# Altium project RPI GPIO BOARD.PrjPcb
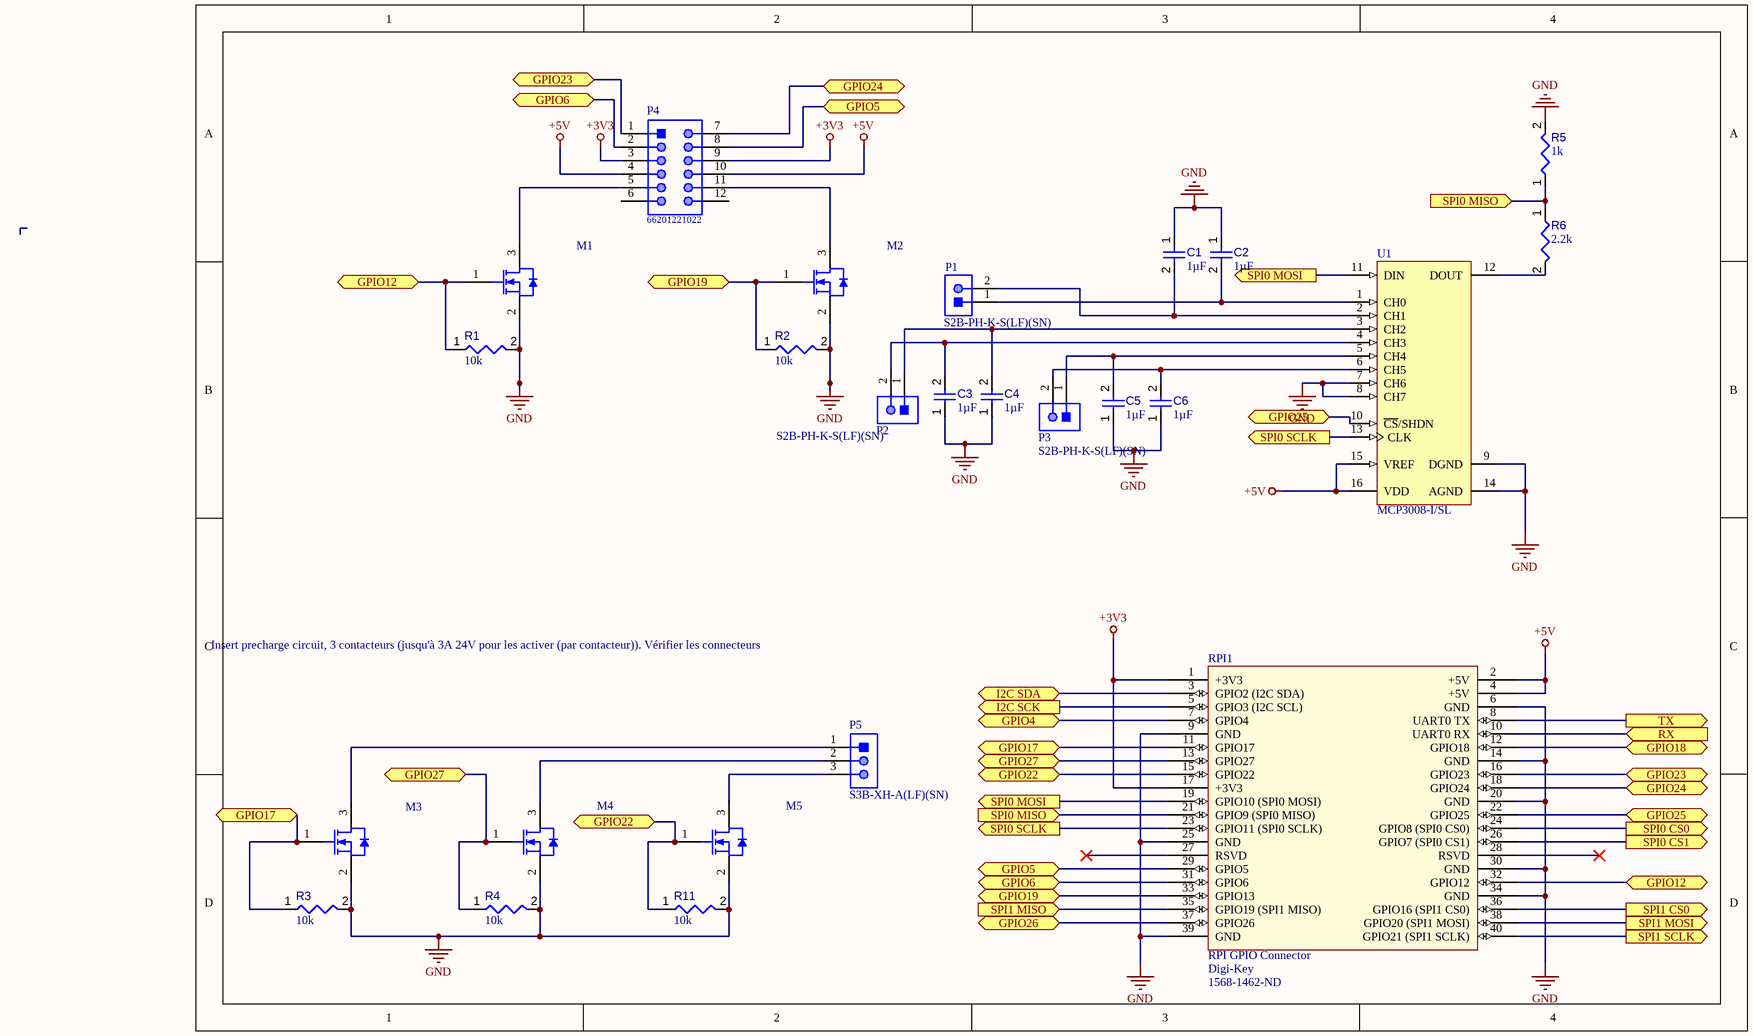
[diagram p0: RPI 3.SchDoc]
mProjectAuthor: Nils Minor; mProjectName: RPI BOARD; mProjectRevision: 0; mProjectVersion: 1
1 sheet, 25 parts. Net scope: flat (ports and power ports of the same name join across sheets).
Board file: RPI 3.PcbDoc

## Sheet RPI 3.SchDoc
size A4; SheetNumber: 1; SheetTotal: 1

### Parts
C1  value 1µF  [CAPC1005X55X25ML5T10]  (hidden comment: Capacitor 1 uF +/- 10% 6.3 V 1005)
C2  value 1µF  [CAPC1005X55X25ML5T10]  (hidden comment: Capacitor 1 uF +/- 10% 6.3 V 1005)
C3  value 1µF  [CAPC1005X55X25ML5T10]  (hidden comment: Capacitor 1 uF +/- 10% 6.3 V 1005)
C4  value 1µF  [CAPC1005X55X25ML5T10]  (hidden comment: Capacitor 1 uF +/- 10% 6.3 V 1005)
C5  value 1µF  [CAPC1005X55X25ML5T10]  (hidden comment: Capacitor 1 uF +/- 10% 6.3 V 1005)
C6  value 1µF  [CAPC1005X55X25ML5T10]  (hidden comment: Capacitor 1 uF +/- 10% 6.3 V 1005)
M1  BSS138  [FAIR-SOT23-3_V]  (value not drawn)
M2  BSS138  [FAIR-SOT23-3_V]  (value not drawn)
M3  BSS138  [FAIR-SOT23-3_V]  (value not drawn)
M4  BSS138  [FAIR-SOT23-3_V]  (value not drawn)
M5  BSS138  [FAIR-SOT23-3_V]  (value not drawn)
P1  S2B-PH-K-S(LF)(SN)  [JST-S2B-PH-K-S_V]
P2  S2B-PH-K-S(LF)(SN)  [JST-S2B-PH-K-S_V]
P3  S2B-PH-K-S(LF)(SN)  [JST-S2B-PH-K-S_V]
P4  66201221022  [66201221022]
P5  S3B-XH-A(LF)(SN)  [JST-S3B-XH-A(LF)(SN)_V]
R1  value 10k  [RESC0402(1005)_L]  (hidden comment: Resistor 10K  +/-1 % 0402 63 mW)
R2  value 10k  [RESC0402(1005)_L]  (hidden comment: Resistor 10K  +/-1 % 0402 63 mW)
R3  value 10k  [RESC0402(1005)_L]  (hidden comment: Resistor 10K  +/-1 % 0402 63 mW)
R4  value 10k  [RESC0402(1005)_L]  (hidden comment: Resistor 10K  +/-1 % 0402 63 mW)
R5  value 1k  [RESC1005X40X25ML10T10]  (hidden comment: Resistor 1k +/-5% 0402 63 mW)
R6  value 2.2k  [RESC0402(1005)_L]  (hidden comment: Resistor 2K2  +/-5 % 0402 63 mW)
R11  value 10k  [RESC0402(1005)_L]  (hidden comment: Resistor 10K  +/-1 % 0402 63 mW)
RPI1  RPI GPIO Connector  Supplier 1: Digi-Key  Supplier Part Number 1: 1568-1462-ND  [rpi]
U1  MCP3008-I/SL  [SOIC-SL16_L]

### Ports
GPIO4 (bidir), GPIO5 (bidir), GPIO6 (bidir), GPIO12 (bidir), GPIO17 (bidir), GPIO18 (bidir), GPIO19 (bidir), GPIO22 (bidir), GPIO23 (bidir), GPIO24 (bidir), GPIO25 (bidir), GPIO26 (bidir), GPIO27 (bidir), I2C SCK (out), I2C SDA (bidir), RX (in), SPI0 CS0 (out), SPI0 CS1 (out), SPI0 MISO (in), SPI0 MOSI (out), SPI0 SCLK (out), SPI1 CS0 (out), SPI1 MISO (in), SPI1 MOSI (out), SPI1 SCLK (out), TX (out)

### Nets
+3V3: P4.3 P4.9 RPI1.1(+3V3) RPI1.17(+3V3)
+5V: P4.4 P4.10 RPI1.2(+5V) RPI1.4(+5V) U1.15(VREF) U1.16(VDD)
GND: C1.1 C2.1 C3.1 C4.1 C5.1 C6.1 M1.2(S) M2.2(S) M3.2(S) M4.2(S) M5.2(S) R1.2 R2.2 R3.2 R4.2 R5.2 R11.2 RPI1.6(GND) RPI1.9(GND) RPI1.14(GND) RPI1.20(GND) RPI1.25(GND) RPI1.30(GND) RPI1.34(GND) RPI1.39(GND) U1.7(CH6) U1.8(CH7) U1.9(DGND) U1.14(AGND)
NetC1_2: C1.2 P1.2 U1.2(CH1)
NetC2_2: C2.2 P1.1 U1.1(CH0)
NetC3_2: C3.2 P2.2 U1.4(CH3)
NetC4_2: C4.2 P2.1 U1.3(CH2)
NetC5_2: C5.2 P3.1 U1.5(CH4)
NetC6_2: C6.2 P3.2 U1.6(CH5)
NetM1_1: M1.1(G) R1.1 RPI1.32(GPIO12) ; port GPIO12
NetM1_3: M1.3(D) P4.5
NetM2_1: M2.1(G) R2.1 RPI1.33(GPIO13) ; port GPIO19
NetM2_3: M2.3(D) P4.11
NetM3_1: M3.1(G) R3.1 RPI1.11(GPIO17) ; port GPIO17
NetM3_3: M3.3(D) P5.1
NetM4_1: M4.1(G) R4.1 RPI1.13(GPIO27) ; port GPIO27
NetM4_3: M4.3(D) P5.2
NetM5_1: M5.1(G) R11.1 RPI1.15(GPIO22) ; port GPIO22
NetM5_3: M5.3(D) P5.3
NetP4_1: P4.1 RPI1.16(GPIO23) ; port GPIO23
NetP4_2: P4.2 RPI1.31(GPIO6) ; port GPIO6
NetP4_7: P4.7 RPI1.18(GPIO24) ; port GPIO24
NetP4_8: P4.8 RPI1.29(GPIO5) ; port GPIO5
NetR5_1: R5.1 R6.1 RPI1.21(GPIO9_(SPI0_MISO)) ; port SPI0 MISO
NetR6_2: R6.2 U1.12(DOUT)
NetRPI1_3: RPI1.3(GPIO2_(I2C_SDA)) ; port I2C SDA
NetRPI1_5: RPI1.5(GPIO3_(I2C_SCL)) ; port I2C SCK
NetRPI1_7: RPI1.7(GPIO4) ; port GPIO4
NetRPI1_8: RPI1.8(UART0_TX) ; port TX
NetRPI1_10: RPI1.10(UART0_RX) ; port RX
NetRPI1_12: RPI1.12(GPIO18) ; port GPIO18
NetRPI1_19: RPI1.19(GPIO10_(SPI0_MOSI)) U1.11(DIN) ; port SPI0 MOSI
NetRPI1_22: RPI1.22(GPIO25) U1.10(~{CS}/SHDN) ; port GPIO25
NetRPI1_23: RPI1.23(GPIO11_(SPI0_SCLK)) U1.13(CLK) ; port SPI0 SCLK
NetRPI1_24: RPI1.24(GPIO8_(SPI0_CS0)) ; port SPI0 CS0
NetRPI1_26: RPI1.26(GPIO7_(SPI0_CS1)) ; port SPI0 CS1
NetRPI1_35: RPI1.35(GPIO19_(SPI1_MISO)) ; port SPI1 MISO
NetRPI1_36: RPI1.36(GPIO16_(SPI1_CS0)) ; port SPI1 CS0
NetRPI1_37: RPI1.37(GPIO26) ; port GPIO26
NetRPI1_38: RPI1.38(GPIO20_(SPI1_MOSI)) ; port SPI1 MOSI
NetRPI1_40: RPI1.40(GPIO21_(SPI1_SCLK)) ; port SPI1 SCLK

Not connected (* = marked no-connect by the designer): P4 6 12; RPI1 27(RSVD)* 28(RSVD)*

### Notes on the sheet
- Insert precharge circuit, 3 contacteurs (jusqu'à 3A 24V pour les activer (par contacteur)). Vérifier les connecteurs

### Library data of the parts
C1-C6 = CMP-001-00009-6: Chip Capacitor, 1 uF, +/- 10%, 6.3 V, 1005 (0402 Metric); Voltage Rating: 6.3V; Capacitor Type: Ceramic; Min Operating Temperature: -55°C; Case/Package: 0402; Tolerance: 10%; Mounting Technology: SM; Max Operating Temperature: 85°C; RoHS Compliant: True; Pins: 2
M1-M5 = CMP-013-00021-4: N-Channel Logic Level Enhancement Mode Field Effect Transistor, 220 mA, 50 V, -55 to 150 degC, 3-Pin SOT-23, RoHS, Tape and Reel; Manufacturer: Fairchild; Elements: 1; Nominal Vgs: 1.3V; Resistance: 0.7Ohm; Typical Rise Time: 9ns; Rds On Max: 3.5Ohm; Nominal Dual Supply Voltage: 50V; Input Capacitance: 27pF; Package Version: Rev. 12, 03/2016; Power: 360mW; Packaging: TapeandReel; Package Description: 3-Pin Small Outline Transistor, Body 2.92 x 1.325 mm, Pitch 0.95 mm; Datasheet URL: https://www.fairchildsemi.com/datasheets/BS/BSS138.pdf; Min Operating Temperature: -55°C; Pins: 3; RoHS Compliant: True; Package Reference: SOT23-3; Package Quantity: 1; Case/Package: TO-236-3; Mounting Technology: SM; Max Operating Temperature: 150°C; Datasheet Version: Rev. C, 10/2005
P1-P3 = CMP-002-00030-2: Male Header, Pitch 2 mm, 1 x 2 Position, Height 4.8 mm, Tail Length 3.4 mm, -25 to 85 degC, RoHS, Bulk; Manufacturer: Japan Solderless Terminals; Package Reference: S2B-PH-K-S; Case/Package: S2B-PH-K-S; Datasheet URL: http://www.jst-mfg.com/product/pdf/eng/ePH.pdf; RoHS Compliant: Unknown; Datasheet Version: Dec-12; Gender: Male; Min Operating Temperature: -25°C; Max Operating Temperature: 85°C; Package Description: Male Header, Pitch 2 mm, 1 x 2 Position, Height 4.8 mm, Tail Length 3.4 mm; Connector Type: Header; Mounting Technology: SM
P4 = CMP-002-00072-1: THT Male Header WR-MPC3, with Snap-in Plastic Pegs, Right Angled, Dual Row, pitch 3 mm, 12 pins
P5 = CMP-002-00033-2: Male Header, Pitch 2.5 mm, 1 x 3 Position, Height 6.1 mm, Tail Length 3.4 mm, -25 to 85 degC, RoHS, Bulk; Manufacturer: JST; Package Description: Male Header, Pitch 2.5 mm, 1 x 3 Position, Height 6.1 mm, Tail Length 3.4 mm; Manufacturer URL: http://www.jst.com/home2.html; Datasheet URL: http://www.jst-mfg.com/product/pdf/eng/eXH.pdf; RoHS Compliant: Unknown; Connector Type: Header; Package Reference: S3B-XH-A(LF)(SN); Gender: Male; Case/Package: S3B-XH-A(LF)(SN); Mounting Technology: TH; Max Operating Temperature: 85°C; Min Operating Temperature: -25°C; Datasheet Version: May-16
R1-R4 R11 = CMP-009-00149-3: Chip Resistor, 10 kOhms, +/-1 %, 63 mW, -55 to 125 degC, 0402; Power: 63mW; Tolerance: 1%; Min Operating Temperature: -55°C; Case/Package: 0402; Max Operating Temperature: 155°C; Pins: 2
R5 = CMP-009-00013-5: Chip Resistor, 1 KOhm, +/- 5%, 0.063 W, -55 to 155 degC, 0402 (1005 Metric); Power: 63mW; Tolerance: 5%; Case/Package: 0402; Mounting Technology: SM; Min Operating Temperature: -55°C; Pins: 2; Max Operating Temperature: 155°C; RoHS Compliant: True
R6 = CMP-009-00166-3: Chip Resistor, 2,2 kOhms, +/-5 %, 63 mW, -55 to 155 degC, 0402; Power: 63mW; Tolerance: 5%; Pins: 2; Min Operating Temperature: -55°C; Max Operating Temperature: 155°C; Case/Package: 0402
RPI1 = rpi connector: GPIO Header for Raspberry Pi A+/B+/Pi 2/Pi 3 - 2x20; Manufacturer: SparkFun Electronics; Manufacturer Part Number: PRT-14017; Nils Minor: author; nilsminor@web.de: mail; RoHS: RoHS Compliant; Category: Development Boards, Kits, Programmers; Stock 1: 150; Pricing 1: 1=1.84 (EUR); Part Status: Active; Accessory Type: Connector; For Use With/Related Products: Raspberry Pi; ComponentLink1URL: https://cdn.sparkfun.com/datasheets/Dev/RaspberryPi/12313.pdf; ComponentLink1Description: https://cdn.sparkfun.com/datasheets/Dev/RaspberryPi/12313.pdf
U1 = CMP-0188-00041-2: 2.7V 4-Channel/8-Channel 10-Bit A/D Converters with SPI Serial Interface, 16-Pin SOIC 150mil, Industrial Temperature; ComponentLink1URL: http://www.microchip.com/; ComponentLink3Description: Package Specification; PackageDescription: 16-Lead Plastic Small Outline (SL) - Narrow, 3.90mm Body [SOIC]; PackageVersion: revBB, Aug-2009; ComponentLink2Description: Datasheet; Code_IPC: SOIC127P600-16; RevisionNote: URLs added.; ComponentLink3URL: http://www.microchip.com/stellent/groups/techpub_sg/documents/packagingspec/en012702.pdf; ComponentLink1Description: Manufacturer URL; ComponentLink2URL: http://ww1.microchip.com/downloads/en/DeviceDoc/21295d.pdf; Code_JEDEC: MS-012-AC; DatasheetVersion: revD, Dec-2008; PackageReference: SOIC-SL16

## Assembly variants
default: all parts fitted